# EAGLE design Rolab_PDD_prot (EAGLE 6.2)
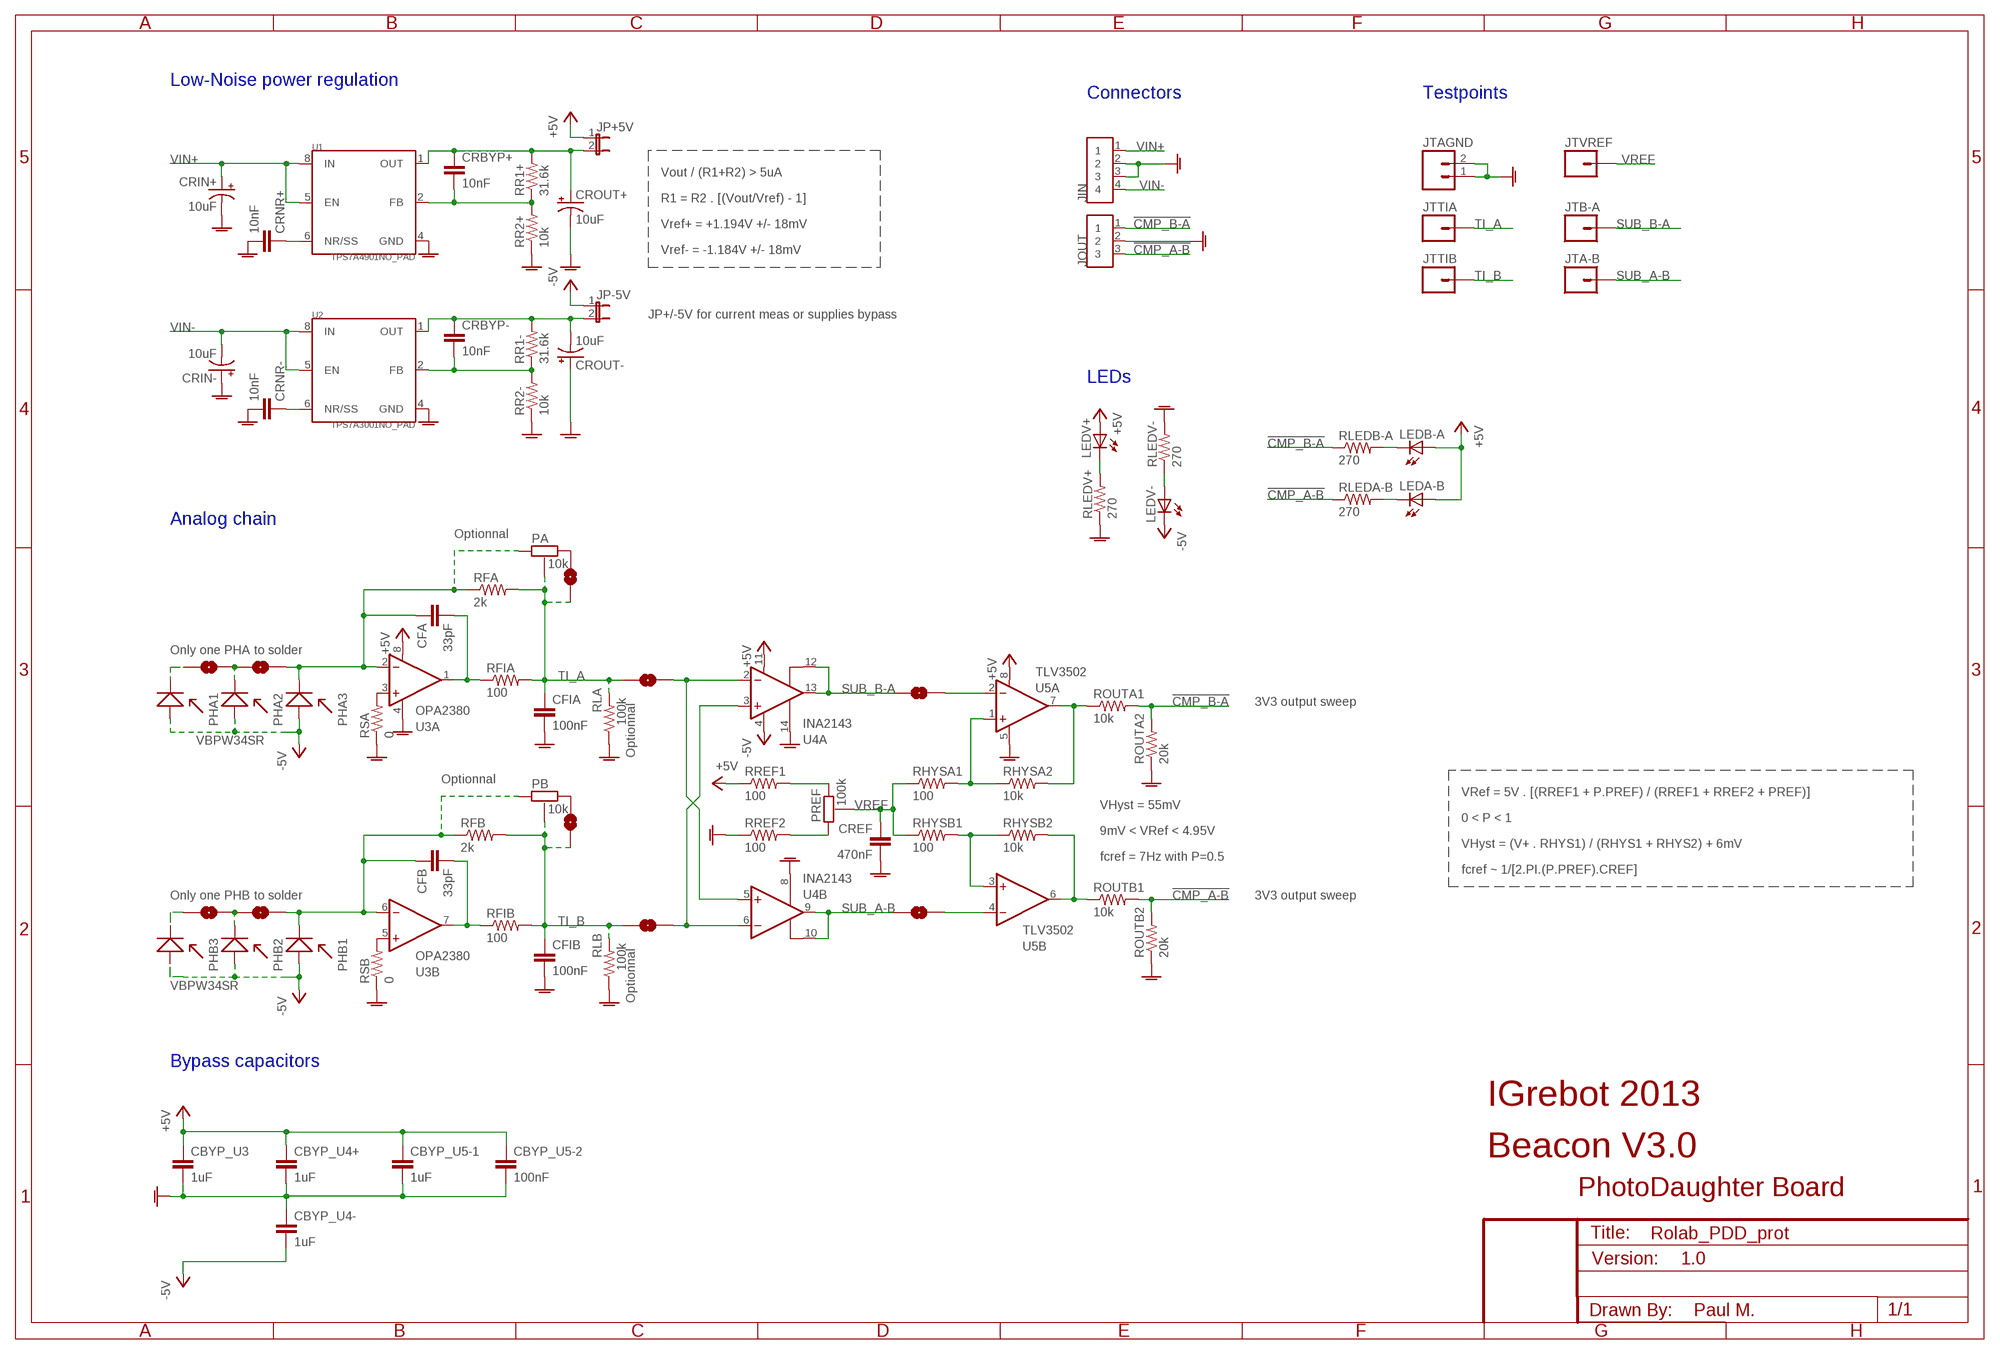
[diagram p0: schematic, sheet 1]

## Parts
CBYP_U3  1uF  CAP0603-CAP  [0603-CAP]
CBYP_U4+  1uF  CAP0603-CAP  [0603-CAP]
CBYP_U4-  1uF  CAP0603-CAP  [0603-CAP]
CBYP_U5-1  1uF  CAP0603-CAP  [0603-CAP]
CBYP_U5-2  100nF  CAP0603-CAP  [0603-CAP]
CFA  33pF  CAP0603-CAP  [0603-CAP]
CFB  33pF  CAP0603-CAP  [0603-CAP]
CFIA  100nF  CAP0603-CAP  [0603-CAP]
CFIB  100nF  CAP0603-CAP  [0603-CAP]
CRBYP+  10nF  CAP0603-CAP  [0603-CAP]
CRBYP-  10nF  CAP0603-CAP  [0603-CAP]
CREF  470nF  CAP0603-CAP  [0603-CAP]
CRIN+  10uF  CAP_POL3528-KIT  [EIA3528-KIT]
CRIN-  10uF  CAP_POL3528-KIT  [EIA3528-KIT]
CRNR+  10nF  CAP0603-CAP  [0603-CAP]
CRNR-  10nF  CAP0603-CAP  [0603-CAP]
CROUT+  10uF  CAP_POL3528-KIT  [EIA3528-KIT]
CROUT-  10uF  CAP_POL3528-KIT  [EIA3528-KIT]
JIN  SIL4  [CON4-2.54]
JOUT  SIL3  [CON3-2.54]
JP+5V  JUMPER-2PTH_LOCK  [1X02_LOCK]
JP-5V  JUMPER-2PTH_LOCK  [1X02_LOCK]
JTA-B  M01PTH  [1X01]
JTAGND  M02LOCK  [1X02_LOCK]
JTB-A  M01PTH  [1X01]
JTTIA  M01PTH  [1X01]
JTTIB  M01PTH  [1X01]
JTVREF  M01PTH  [1X01]
LEDA-B  LED0603  [LED-0603]
LEDB-A  LED0603  [LED-0603]
LEDV+  LED0603  [LED-0603]
LEDV-  LED0603  [LED-0603]
PA  10k  PVZ2A  [TRIM-PVZ2A]
PB  10k  PVZ2A  [TRIM-PVZ2A]
PHA1  VBPW34SR  [VBPW34SR]
PHA2  VBPW34SR  [VBPW34SR]
PHA3  VBPW34SR  [VBPW34SR]
PHB1  VBPW34SR  [VBPW34SR]
PHB2  VBPW34SR  [VBPW34SR]
PHB3  VBPW34SR  [VBPW34SR]
PREF  100k  PVZ2A  [TRIM-PVZ2A]
RFA  2k  RESISTOR0603-RES  [0603-RES]
RFB  2k  RESISTOR0603-RES  [0603-RES]
RFIA  100  RESISTOR0603-RES  [0603-RES]
RFIB  100  RESISTOR0603-RES  [0603-RES]
RHYSA1  100  RESISTOR0603-RES  [0603-RES]
RHYSA2  10k  RESISTOR0603-RES  [0603-RES]
RHYSB1  100  RESISTOR0603-RES  [0603-RES]
RHYSB2  10k  RESISTOR0603-RES  [0603-RES]
RLA  100k  RESISTOR0603-RES  [0603-RES]
RLB  100k  RESISTOR0603-RES  [0603-RES]
RLEDA-B  270  RESISTOR0603-RES  [0603-RES]
RLEDB-A  270  RESISTOR0603-RES  [0603-RES]
RLEDV+  270  RESISTOR0603-RES  [0603-RES]
RLEDV-  270  RESISTOR0603-RES  [0603-RES]
ROUTA1  10k  RESISTOR0603-RES  [0603-RES]
ROUTA2  20k  RESISTOR0603-RES  [0603-RES]
ROUTB1  10k  RESISTOR0603-RES  [0603-RES]
ROUTB2  20k  RESISTOR0603-RES  [0603-RES]
RR1+  31.6k  RESISTOR0603-RES  [0603-RES]
RR1-  31.6k  RESISTOR0603-RES  [0603-RES]
RR2+  10k  RESISTOR0603-RES  [0603-RES]
RR2-  10k  RESISTOR0603-RES  [0603-RES]
RREF1  100  RESISTOR0603-RES  [0603-RES]
RREF2  100  RESISTOR0603-RES  [0603-RES]
RSA  0  RESISTOR0603-RES  [0603-RES]
RSB  0  RESISTOR0603-RES  [0603-RES]
SJ1  SOLDERJUMPERNC  [SJ_2S]
SJ2  SOLDERJUMPERNC  [SJ_2S]
SJ3  SOLDERJUMPERNC  [SJ_2S]
SJ4  SOLDERJUMPERNC  [SJ_2S]
SJ5  SOLDERJUMPERNC  [SJ_2S]
SJ6  SOLDERJUMPERNC  [SJ_2S]
SJ7  SOLDERJUMPERNC  [SJ_2S]
SJ8  SOLDERJUMPERNC  [SJ_2S]
SJ9  SOLDERJUMPERNC  [SJ_2S]
SJ11  SOLDERJUMPERNC  [SJ_2S]
U1  TPS7A4901NO_PAD  [MSOP8]
U2  TPS7A3001NO_PAD  [MSOP8]
U3  OPA2380  [MSOP8]
U4  INA2143  [SOIC14]
U5  TLV3502  [SOIC8]

## Nets
!CMP_A-B!: JOUT.3 RLEDA-B.1 ROUTB1.2 ROUTB2.2
!CMP_B-A!: JOUT.1 RLEDB-A.1 ROUTA1.2 ROUTA2.2
+5V: CBYP_U3.1 CBYP_U4+.1 CBYP_U5-1.1 CBYP_U5-2.1 JP+5V.1 LEDA-B.A LEDB-A.A LEDV+.A RREF1.1 U3.8(A:V+) U4.11(A:V+) U5.8(A:V+)
-5V: CBYP_U4-.2 JP-5V.1 LEDV-.C PHA1.A PHA2.A PHA3.A PHB1.A PHB2.A PHB3.A U4.4(A:V-)
AGND: CBYP_U3.2 CBYP_U4+.2 CBYP_U4-.1 CBYP_U5-1.2 CBYP_U5-2.2 CFIA.2 CFIB.2 CREF.2 CRIN+.C(-) CRIN-.A(+) CRNR+.2 CRNR-.2 CROUT+.C(-) CROUT-.A(+) JIN.2 JIN.3 JOUT.2 JTAGND.1 JTAGND.2 RLA.1 RLB.1 RLEDV+.1 RLEDV-.2 ROUTA2.1 ROUTB2.1 RR2+.1 RR2-.1 RREF2.1 RSA.1 RSB.1 U1.4(GND) U2.4(GND) U3.4(A:V-) U4.8(B:REF) U4.14(A:REF) U5.5(A:V-)
N$1: CRNR+.1 U1.6(NR/SS)
N$2: CRBYP-.2 RR1-.1 RR2-.2 U2.2(FB)
N$3: CFA.2 RFIA.1 U3.1(A:OUT)
N$4: CRNR-.1 U2.6(NR/SS)
N$5: CFA.1 PA.3(C) PHA3.K RFA.1 SJ7.2 U3.2(A:-IN)
N$6: CFB.2 RFIB.1 U3.7(B:OUT)
N$7: CRBYP+.2 RR1+.1 RR2+.2 U1.2(FB)
N$8: CFB.1 PB.3(C) PHB1.K RFB.1 SJ5.2 U3.6(B:-IN)
N$9: SJ2.2 U4.3(A:+IN) U4.6(B:-IN)
N$10: RHYSA2.2 ROUTA1.1 U5.7(A:OUT)
N$11: SJ1.2 U4.2(A:-IN) U4.5(B:+IN)
N$12: SJ3.2 U5.2(A:-IN)
N$13: SJ4.2 U5.4(B:-IN)
N$14: RHYSA1.2 RHYSA2.1 U5.1(A:+IN)
N$15: RHYSB1.2 RHYSB2.1 U5.3(B:+IN)
N$16: RHYSB2.2 ROUTB1.1 U5.6(B:OUT)
N$17: PREF.1(A) RREF1.2
N$18: PREF.3(C) RREF2.2
N$19: LEDV+.C RLEDV+.2
N$20: LEDV-.A RLEDV-.1
N$21: LEDB-A.C RLEDB-A.2
N$22: LEDA-B.C RLEDA-B.2
N$23: RSA.2 U3.3(A:+IN)
N$24: RSB.2 U3.5(B:+IN)
N$26: PA.1(A) SJ8.2
N$27: PHB2.K SJ5.1 SJ9.2
N$28: CRBYP+.1 CROUT+.A(+) JP+5V.2 RR1+.2 U1.1(OUT)
N$29: PHA2.K SJ7.1 SJ11.2
N$30: CRBYP-.1 CROUT-.C(-) JP-5V.2 RR1-.2 U2.1(OUT)
N$31: PHA1.K SJ11.1
N$33: PHB3.K SJ9.1
N$9991: PB.1(A) SJ6.2
SUB_A-B: JTA-B.1 SJ4.1 U4.9(B:OUT) U4.10(B:SENSE)
SUB_B-A: JTB-A.1 SJ3.1 U4.12(A:SENSE) U4.13(A:OUT)
TI_A: CFIA.1 JTTIA.1 PA.2(B) RFA.2 RFIA.2 RLA.2 SJ1.1 SJ8.1
TI_B: CFIB.1 JTTIB.1 PB.2(B) RFB.2 RFIB.2 RLB.2 SJ2.1 SJ6.1
VIN+: CRIN+.A(+) JIN.1 U1.5(EN) U1.8(IN)
VIN-: CRIN-.C(-) JIN.4 U2.5(EN) U2.8(IN)
VREF: CREF.1 JTVREF.1 PREF.2(B) RHYSA1.1 RHYSB1.1

## Notes on the sheet
- Low-Noise power regulation
- Connectors | Testpoints
- Vout / (R1+R2) > 5uA
- R1 = R2 . [(Vout/Vref) - 1]
- Vref+ = +1.194V +/- 18mV
- Vref- = -1.184V +/- 18mV
- JP+/-5V for current meas or supplies bypass
- LEDs
- Analog chain
- Optionnal
- Only one PHA to solder
- 3V3 output sweep
- Optionnal
- Optionnal
- VRef = 5V . [(RREF1 + P.PREF) / (RREF1 + RREF2 + PREF)]
- VHyst = 55mV
- 0 < P < 1
- 9mV < VRef < 4.95V
- VHyst = (V+ . RHYS1) / (RHYS1 + RHYS2) + 6mV
- fcref = 7Hz with P=0.5
- fcref ~ 1/[2.PI.(P.PREF).CREF]
- Only one PHB to solder | 3V3 output sweep
- Optionnal
- Bypass capacitors
- IGrebot 2013
- Beacon V3.0
- PhotoDaughter Board
- 1.0
- Paul M.

## Library data of the parts
CBYP_U3 CBYP_U4+ CBYP_U4- CBYP_U5-1 CBYP_U5-2 CFA CFB CFIA CFIB CRBYP+ CRBYP- CREF CRNR+ CRNR- = SparkFun-Passives:CAP: Capacitor Standard 0603 ceramic capacitor, and 0.1" leaded capacitor.
CRIN+ CRIN- CROUT+ CROUT- = SparkFun-Passives:CAP_POL: Capacitor Polarized These are standard SMD and PTH capacitors. Normally 10uF, 47uF, and 100uF in electrolytic and tantalum varieties. Always verify the external diameter of the through hole cap, it varies with capacity, voltage, and manufacturer. The EIA devices should be standard.
JIN = lib_paul_v6:SIL4
JOUT = lib_paul_v6:SIL3
JP+5V JP-5V = SparkFun-Passives:JUMPER-2: Jumper Basic 0.1" spaced jumper. Use with breakaway headers.
JTA-B JTB-A JTTIA JTTIB JTVREF = SparkFun-Connectors:M01: Header 1 Standard 1-pin 0.1" header. Use with straight break away headers (SKU : PRT-00116), right angle break away headers (PRT-00553), swiss pins (PRT-00743), machine pins (PRT-00117), and female headers (PRT-00115).
JTAGND = SparkFun-Connectors:M02: Header 2 Standard 2-pin 0.1" header. Use with straight break away headers (SKU : PRT-00116), right angle break away headers (PRT-00553), swiss pins (PRT-00743), machine pins (PRT-00117), and female headers (PRT-00115). Molex polarized connector foot print use with SKU : PRT-08233 with associated crimp pins and housings.
LEDA-B LEDB-A LEDV+ LEDV- = SparkFun-LED:LED: LEDs Standard schematic elements and footprints for 5mm, 3mm, 1206, and 0603 sized LEDs. 5mm - Spark Fun Electronics SKU : COM-00529 (and others)
PA PB PREF = lib_paul_v6:PVZ2A
PHA1-PHA3 PHB1-PHB3 = lib_paul_v6:VBPW34SR
RFA RFB RFIA RFIB RHYSA1 RHYSA2 RHYSB1 RHYSB2 RLA RLB RLEDA-B RLEDB-A RLEDV+ RLEDV- ROUTA1 ROUTA2 ROUTB1 ROUTB2 RR1+ RR1- RR2+ RR2- RREF1 RREF2 RSA RSB = SparkFun-Passives:RESISTOR: Resistor Basic schematic elements and footprints for 0603, 1206, and PTH resistors.
SJ1-SJ9 SJ11 = SparkFun-Passives:SOLDERJUMPER: Solder Jumper Standard SMD solder jumper. Used to automate production. Two varients : Normally Open and Normally Closed are the same, but have different paste layers. NC will have a large amount of paste and should jumper during reflow.
U1 = lib_paul_v6:TPS7A4901
U2 = lib_paul_v6:TPS7A3001
U3 = lib_paul_v6:OPA2380
U4 = lib_paul_v6:INA2143
U5 = lib_paul_v6:TLV3502

## Board
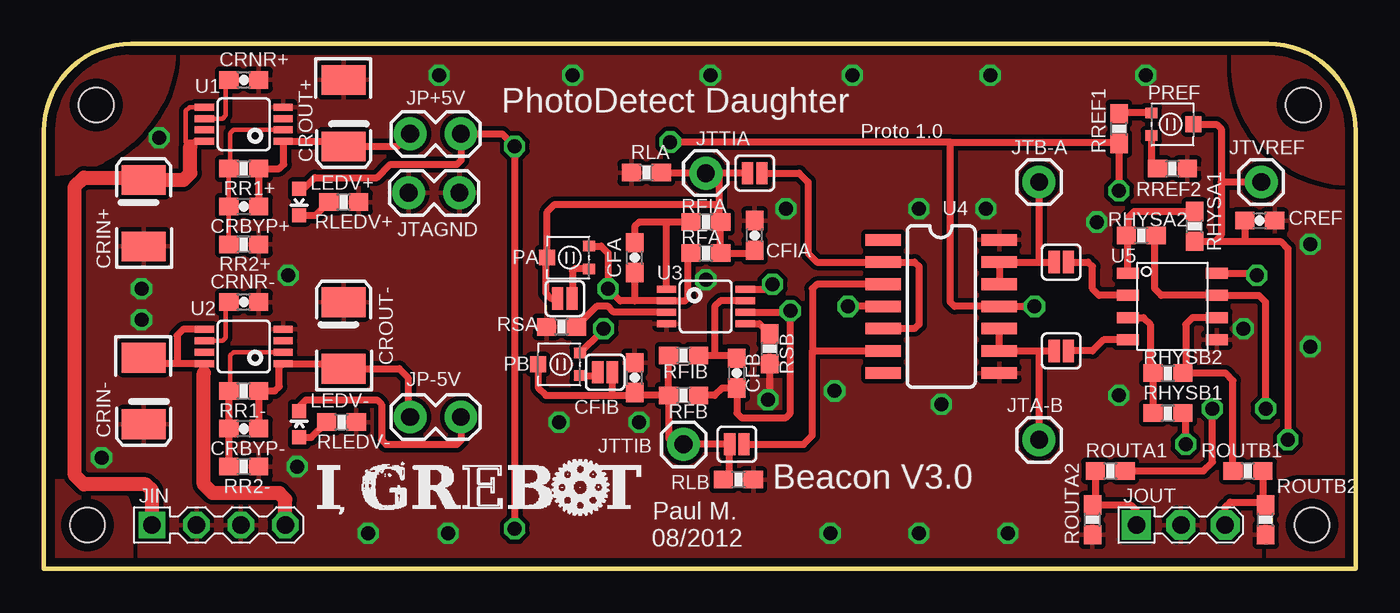
[diagram p1: board, top side]
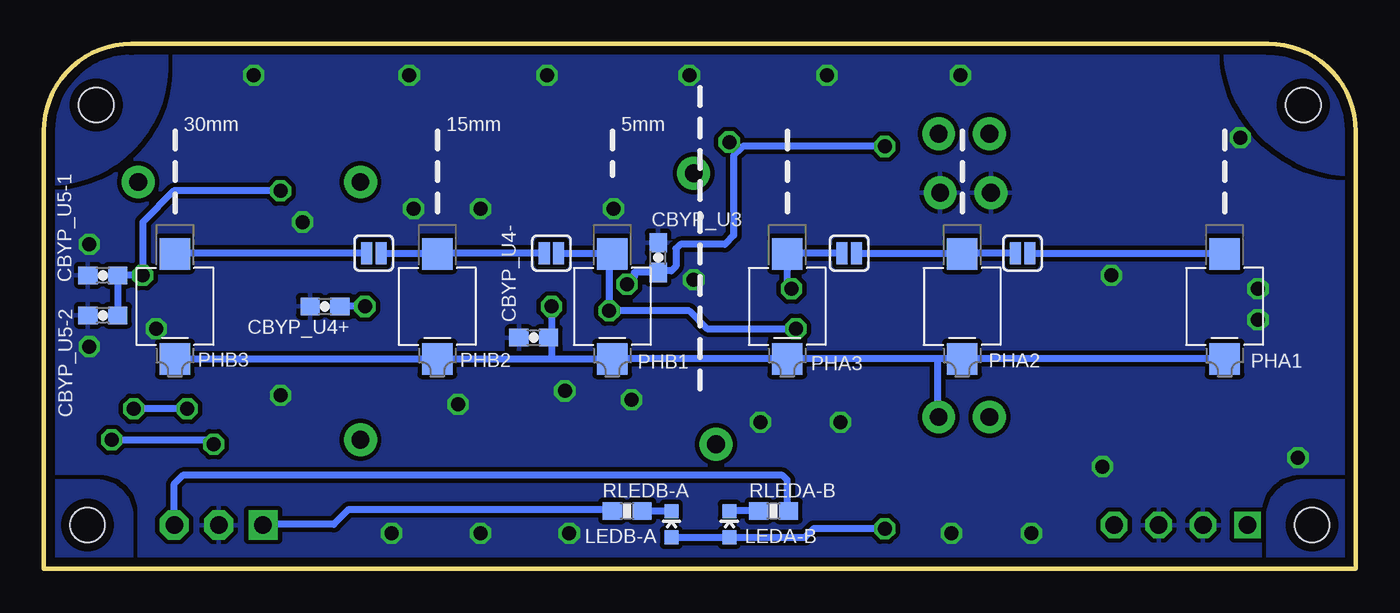
[diagram p2: board, bottom side, seen from below]

Size 75 x 30 mm. Coordinates in mm from the lower left corner, seen from the top.
Outline: 0,0 75,0 75,25 arc90 70,30 5,30 arc90 0,25 0,0
Copper layers (1*16): Top 0.035mm / dielectric 1.5mm / Bottom 0.035mm
Design rules: minimum track width 10mil, minimum drill 24mil, track to track 8mil, track to pad 8mil, pad to pad 8mil, via to via 8mil, smd to smd 8mil, copper to edge 20mil, drill to drill 8mil, minimum pad ring 10mil, minimum via ring 8mil, stop-mask expansion 4mil, vias tented up to drill 0mil, thermal gap 10mil
Holes 2 mm at 2.5,2.5 72.5,2.5 72,26.5 3,26.5

### Footprints (pad centres in the part's own frame; a part is rotated, then mirrored left to right if it is on the bottom)
0603-CAP = smd 1.1 x 1: 1 -0.85,0; 2 0.85,0
EIA3528-KIT = smd 1.7 x 2.5: A 1.9,0; C -1.9,0
CON4-2.54 = drill 1 square: 1 -3.81,0 | drill 1 octagon: 2 -1.27,0; 3 1.27,0; 4 3.81,0
CON3-2.54 = drill 1 pad 1.676 square: 1 -2.54,0 | drill 1 pad 1.676 octagon: 2 0,0; 3 2.54,0
1X02_LOCK = drill 1.016 pad 1.88: 1 -0.178,0; 2 2.718,0
1X01 = drill 1.016 pad 1.88: 1 0,0
LED-0603 = smd 0.8 x 0.8: A 0,-0.75; C 0,0.75
TRIM-PVZ2A = smd 0.6 x 0.7: 1 -0.65,-1.2; 3 0.65,-1.2 | smd 0.9 x 0.9: 2 0,1.2
VBPW34SR = smd 1.8 x 1.75: A -3,0; K 3,0
0603-RES = smd 1.1 x 1: 1 -0.85,0; 2 0.85,0
SJ_2S = smd 0.635 x 1.27: 1 -0.412,0; 2 0.412,0
MSOP8 = smd 0.4 x 1.1: 1 -0.975,-2.25; 2 -0.325,-2.25; 3 0.325,-2.25; 4 0.975,-2.25; 5 0.975,2.25; 6 0.325,2.25; 7 -0.325,2.25; 8 -0.975,2.25
SOIC14 = smd 0.66 x 2.032: 1 -3.81,-3.315; 2 -2.54,-3.315; 3 -1.27,-3.315; 4 0,-3.315; 5 1.27,-3.315; 6 2.54,-3.315; 7 3.81,-3.315; 8 3.81,3.315; 9 2.54,3.315; 10 1.27,3.315; 11 0,3.315; 12 -1.27,3.315; 13 -2.54,3.315; 14 -3.81,3.315
SOIC8 = smd 0.635 x 1.27: 1 -1.905,-2.54; 2 -0.635,-2.54; 3 0.635,-2.54; 4 1.905,-2.54; 5 1.905,2.54; 6 0.635,2.54; 7 -0.635,2.54; 8 -1.905,2.54

### Placement (x,y rotation side)
CBYP_U3  39.88,17.78 90 bottom
CBYP_U4+  58.93,14.99 180 bottom
CBYP_U4-  46.99,13.21 0 bottom
CBYP_U5-1  71.63,16.76 180 bottom
CBYP_U5-2  71.63,14.48 180 bottom
CFA  33.78,17.78 90 top
CFB  39.62,11.18 90 top
CFIA  40.64,19.05 90 top
CFIB  33.78,10.92 90 top
CRBYP+  11.43,20.7 180 top
CRBYP-  11.43,8 180 top
CREF  69.51,19.89 0 top
CRIN+  5.71,20.32 90 top
CRIN-  5.71,10.16 270 top
CRNR+  11.43,27.94 0 top
CRNR-  11.43,15.24 0 top
CROUT+  17.14,26.04 270 top
CROUT-  17.14,13.34 90 top
JIN  10,2.5 0 top
JOUT  65,2.5 0 top
JP+5V  23.66,24.85 180 top
JP-5V  23.66,8.67 180 top
JTA-B  56.9,7.37 0 top
JTAGND  21.04,21.48 0 top
JTB-A  56.9,22.1 0 top
JTTIA  37.85,22.61 0 top
JTTIB  36.58,7.11 0 top
JTVREF  69.6,22.1 0 top
LEDA-B  35.81,2.54 0 bottom
LEDB-A  39.12,2.54 0 bottom
LEDV+  14.61,20.95 180 top
LEDV-  14.61,8.26 0 top
PA  29.97,17.78 90 top
PB  29.46,11.68 90 top
PHA1  7.5,15 90 bottom
PHA2  22.5,15 90 bottom
PHA3  32.5,15 90 bottom
PHB1  42.5,15 90 bottom
PHB2  52.5,15 90 bottom
PHB3  67.5,15 90 bottom
PREF  64.52,25.4 270 top
RFA  37.85,18.03 0 top
RFB  36.58,9.91 180 top
RFIA  37.85,19.81 0 top
RFIB  36.58,12.19 180 top
RHYSA1  65.79,19.56 90 top
RHYSA2  62.74,19.05 0 top
RHYSB1  64.26,8.89 180 top
RHYSB2  64.26,11.18 0 top
RLA  34.46,22.64 0 top
RLB  39.71,5.1 180 top
RLEDA-B  33.27,3.3 180 bottom
RLEDB-A  41.66,3.3 0 bottom
RLEDV+  17.14,20.95 180 top
RLEDV-  17.02,8.38 0 top
ROUTA1  60.96,5.59 180 top
ROUTA2  59.94,2.79 90 top
ROUTB1  68.83,5.59 0 top
ROUTB2  69.85,2.79 90 top
RR1+  11.43,22.86 0 top
RR1-  11.43,10.16 0 top
RR2+  11.43,18.54 180 top
RR2-  11.43,5.84 180 top
RREF1  61.47,25.15 90 top
RREF2  64.52,22.86 180 top
RSA  29.59,13.83 0 top
RSB  41.5,12.57 90 top
SJ1  40.64,22.61 0 top
SJ2  39.62,7.11 0 top
SJ3  58.17,17.53 0 top
SJ4  58.17,12.45 0 top
SJ5  45.97,18.03 0 bottom
SJ6  32.09,11.23 180 top
SJ7  28.96,18.03 180 bottom
SJ8  29.78,15.44 0 top
SJ9  56.13,18.03 0 bottom
SJ11  19.05,18.03 180 bottom
U1  11.43,25.4 90 top
U2  11.43,12.7 90 top
U3  37.85,14.99 270 top
U4  51.31,14.99 270 top
U5  64.52,14.99 270 top

### Tracks (layer width: path | path; a pad name or v marks a point on that pad's centre or on a via)
!CMP_A-B!
  Top 0.406: JOUT.3 67.54,3.53 67.82,3.81 69.68,3.81 | ROUTB1.2 69.68,3.81 | 69.68,3.81 ROUTB2.2
  Bottom 0.406: JOUT.3 67.56,2.52 67.56,4.83 67.06,5.33 32.77,5.33 32.51,5.08 32.51,3.39 RLEDA-B.1
!CMP_B-A!
  Top 0.406: JOUT.1 62.48,2.52 62.48,3.3 62.14,3.64 ROUTA2.2 60.11,3.81 ROUTA1.2
  Bottom 0.406: JOUT.1 62.42,2.54 58.42,2.54 57.57,3.39 42.59,3.39 RLEDB-A.1
+5V  (via drill 0.8)
  Top 0.406: U3.8 41.36,15.96 v41.66,16.26 | v56.64,14.99 U4.11 52.07,14.99 51.82,15.24 51.82,24.38 | U5.8 69.22,16.89 v69.34,16.76 | 51.82,24.38 61.38,24.38 RREF1.1 v61.47,21.59 | 51.82,24.38 v35.81,24.38 | v26.92,2.29 v26.92,24.13 26.2,24.85 JP+5V.1 23.88,24.82 23.88,23.37 23.62,23.11 19.81,23.11 19.05,22.35 15.49,22.35 14.85,21.7 LEDV+.A
  Bottom 0.406: v56.64,14.99 CBYP_U4+.1 | v69.34,16.76 69.85,16.76 | 69.85,16.76 CBYP_U5-1.1 CBYP_U5-2.1 | v61.47,21.59 67.56,21.59 69.34,19.81 69.34,17.02 69.85,16.76 | v26.92,24.13 35.05,24.13 35.18,24 | 35.18,24 35.56,23.62 35.56,19.05 36.07,18.54 38.61,18.54 38.86,18.29 38.86,17.27 39.12,17.02 40.04,17.02 CBYP_U3.1 41.24,16.93 41.24,16.68 v41.66,16.26 | LEDB-A.A LEDA-B.A 31.48,1.79 30.99,2.29 v26.92,2.29 | v35.81,24.38 35.56,24.38 35.18,24
-5V  (via drill 0.8)
  Top 0.406: U4.4 v45.97,14.99 | LEDV-.C 14.61,9.27 14.99,9.65 19.05,9.65 19.3,9.4 19.3,7.37 19.56,7.11 23.62,7.11 23.88,7.37 23.88,8.64 JP-5V.1
  Bottom 0.406: PHA1.A PHA2.A 23.88,12 | v45.97,14.99 45.97,13.37 | 45.97,13.37 CBYP_U4-.2 | PHB3.A PHB2.A 45.97,12 | 45.97,12 PHB1.A PHA3.A 23.88,12 | 45.97,13.37 45.97,12 | JP-5V.1 23.88,8.67 23.88,12
AGND  (via drill 0.8)
  Top 0.406: RSB.1 41.5,9.75 v41.4,9.65
  other vias: 34.04,8.38 29.46,8.38 18.54,2.03 23.11,2.03 44.96,2.03 50.04,2.03 55.12,2.03 51.31,9.4 50.04,20.57 45.21,10.16 42.42,20.57 22.61,28.19 30.23,28.19 38.1,28.19 46.23,28.19 54.1,28.19 62.99,28.19 61.47,9.91 5.59,16 5.59,14.22 3.3,6.35 6.6,24.64 13.97,16.76 14.48,5.84 53.85,20.57 60.2,19.81 72.39,12.7 72.39,18.54 68.58,13.72 37.85,16.51
  pour Top (isolate 0.254, rank 2): -0.25,-0.25 -0.25,30.48 75.44,30.48 75.44,-0.25
  pour Bottom (isolate 0.254, rank 5): -0.25,-0.25 75.44,-0.25 75.44,30.23 -0.51,30.23 -0.51,-0.25
GNDHOLE
  pour Top (isolate 0.254): 7.5,30 arc-90 0,22.5 0,25.5 arc-90 5.5,30
  pour Bottom (isolate 0.254): 7.5,30 arc-90 0,22.5 0,25.5 arc-90 5.5,30
  pour Top (isolate 0.254): 75,22 75,25 arc90 70,30 68,30 68,28.5 arc90
  pour Bottom (isolate 0.254): 75,22 75,25 arc90 70,30 68,30 68,28.5 arc90
  pour Top (isolate 0.254): 0,0 5,0 5,3 arc90 3,5 0,5
  pour Bottom (isolate 0.254): 0,0 5,0 5,3 arc90 3,5 0,5
  pour Top (isolate 0.254): 75,0 70,0 70,3 arc-90 72,5 75,5
  pour Bottom (isolate 0.254): 75,0 70,0 70,3 arc-90 72,5 75,5
N$1
  Top 0.254: U1.6 10.23,25.73 10.41,25.91 10.41,27.77 CRNR+.1
N$2
  Top 0.254: U2.2 10.85,12.38 10.67,12.19 10.67,10.25 RR1-.1
  Top 0.406: RR1-.1 CRBYP-.2 RR2-.2
N$3
  Top 0.406: RFIA.1 35.56,19.81 | 35.56,19.81 34.04,19.81 33.78,19.56 CFA.2 | U3.1 35.6,19.78 35.56,19.81
N$4
  Top 0.254: U2.6 10.23,13.03 10.41,13.21 10.41,15.07 CRNR-.1
N$5  (via drill 0.8)
  Top 0.406: 33.78,15.31 U3.2 36.65,15.31 36.83,15.49 36.83,17.61 RFA.1 | 33.78,15.31 32.95,15.31 v32.26,16 32.26,18.03 31.86,18.43 PA.3 | CFA.1 33.78,15.31
  Bottom 0.406: 32.47,18.54 PHA3.K | PHA3.K 32.51,18.56 32.51,16.26 v32.26,16 | SJ7.2 32.5,18.03 PHA3.K
N$6
  Top 0.406: U3.7 38.68,15.31 38.35,14.99 38.35,12.19 | RFIB.1 38.35,12.19 | 38.35,12.19 39.46,12.19 CFB.2
N$7
  Top 0.254: RR2+.2 CRBYP+.2 RR1+.1 10.67,22.95 10.67,24.89 10.85,25.07 U1.2
N$8  (via drill 0.8)
  Top 0.406: U3.6 42.35,14.66 v42.67,14.73 42.67,8.89 42.42,8.64 39.88,8.64 39.62,8.89 CFB.1 38.77,10.33 38.35,9.91 RFB.1 | PB.3 31.79,13.46 31.79,13.5 v32,13.72
  Bottom 0.406: SJ5.2 42.5,18.03 PHB1.K 42.59,18.57 42.67,18.49 42.42,18.49 42.67,18.29 v42.67,14.73 38.1,14.73 37.08,13.72 v32,13.72
N$9
  Top 0.406: SJ2.2 43.43,7.11 43.94,7.62 43.94,12.45 | 43.94,12.45 U4.6 | U4.3 44.2,16.26 43.94,16 43.94,12.45
N$10  (via drill 0.8)
  Top 0.406: RHYSA2.2 63.5,18.96 63.5,16 63.88,15.62 U5.7 69.47,15.62 69.85,15.24 v69.85,9.14 | ROUTA1.1 66.29,5.59 66.8,6.1 v66.8,9.14
  Bottom 0.406: v66.8,9.14 v69.85,9.14
N$11
  Top 0.406: SJ1.2 43.18,22.61 43.69,22.1 43.69,18.03 44.2,17.53 U4.2 49.78,17.53 50.04,17.27 50.04,13.97 49.78,13.72 U4.5
N$12
  Top 0.406: SJ3.2 59.69,17.53 59.94,17.27 59.94,16 60.33,15.62 U5.2
N$13
  Top 0.406: U5.4 60.58,13.08 59.94,12.45 SJ4.2
N$14
  Top 0.406: U5.1 61.98,18.96 RHYSA2.1 61.98,19.14 61.98,20.07 62.32,20.41 RHYSA1.2
N$15
  Top 0.406: U5.3 62.87,14.35 63.25,13.97 63.25,11.34 RHYSB2.1 RHYSB1.2
N$16
  Top 0.406: U5.6 65.66,14.35 65.28,13.97 65.28,11.34 RHYSB2.2 67.56,11.18 67.98,10.76 ROUTB1.1
N$17
  Top 0.406: PREF.1 61.52,26.05 RREF1.2
N$18
  Top 0.406: PREF.3 63.32,23.21 RREF2.2
N$19
  Top 0.406: LEDV+.C 15.54,20.2 RLEDV+.2
N$20
  Top 0.406: LEDV-.A 15.29,7.5 RLEDV-.1
N$21
  Bottom 0.406: LEDB-A.C 40.79,3.29 RLEDB-A.2
N$22
  Bottom 0.406: RLEDA-B.2 35.8,3.3 LEDA-B.C
N$23
  Top 0.406: U3.3 32.58,14.66 32.26,14.99 31.6,14.99 RSA.2
N$24
  Top 0.406: U3.5 40.91,14.01 RSB.2
N$26
  Top 0.406: PA.1 30.34,17.13 30.23,17.02 30.23,15.47 SJ8.2
N$27
  Bottom 0.406: 52.47,18.54 PHB2.K 52.5,18.03 | SJ5.1 52.5,18.03 | SJ9.2 52.5,18.03
N$28
  Top 0.406: CRBYP+.1 RR1+.2 13.46,22.86 13.72,23.11 13.72,24.39 U1.1 16.86,24.43 CROUT+.A 20.23,24.14 JP+5V.2
N$29
  Bottom 0.406: 22.53,18.54 PHA2.K | 22.47,18.54 PHA2.K | SJ11.2 22.5,18.03 | SJ7.1 22.5,18.03 | 22.5,18.03 PHA2.K
N$30
  Top 0.406: CRBYP-.1 RR1-.2 13.21,10.16 13.46,10.41 13.46,11.51 U2.1 16.86,11.72 CROUT-.C 20.32,11.44 20.83,10.92 20.83,8.79 JP-5V.2
N$31
  Bottom 0.406: SJ11.1 7.5,18.03 PHA1.K
N$33
  Bottom 0.406: 67.47,18.54 PHB3.K 67.5,18.03 SJ9.1
N$9991
  Top 0.406: PB.1 31.48,11.03 SJ6.2
SUB_A-B
  Top 0.406: U4.10 U4.9 56.9,12.45 | 56.9,12.45 SJ4.1 | 56.9,12.45 JTA-B.1
SUB_B-A
  Top 0.406: U4.12 U4.13 56.9,17.53 | 56.9,17.53 SJ3.1 | JTB-A.1 56.9,17.53
TI_A
  Top 0.406: CFIA.1 40.47,18.03 RFA.2 RFIA.2 38.61,19.9 38.61,20.57 | 38.61,22.61 38.61,20.57 | SJ1.1 38.61,22.61 | 38.61,22.61 JTTIA.1 37.85,22.64 RLA.2 | 38.61,20.57 38.35,20.83 29.21,20.83 28.77,20.39 PA.2 28.7,17.71 28.7,15.75 29.01,15.44 SJ8.1
TI_B
  Top 0.406: RFB.2 RFIB.2 | RFB.2 33.95,9.91 CFIB.1 33.62,9.91 32.51,9.91 | RFB.2 35.73,7.45 36.07,7.11 JTTIB.1 SJ2.1 39.21,5.1 RLB.2 | PB.2 28.26,10.34 28.7,9.91 32.51,9.91 | SJ6.1 32.5,9.92 32.51,9.91
VIN+
  Top 0.254: U1.5 8.34,26.38 8.13,26.16 8.13,24.38 8.38,24.13
  Top 0.406: U1.8 8.68,24.43 8.38,24.13
  Top 0.813: JIN.1 6.19,4.48 5.84,4.83 2.29,4.83 1.78,5.33 1.78,21.84 2.29,22.35 5.58,22.35 CRIN+.A 8,22.22 8.38,22.61 8.38,24.13
VIN-
  Top 0.406: 7.62,11.72 U2.8 9.14,11.54 9.14,11.18 | 7.62,11.72 6.05,11.72 CRIN-.C | U2.5 7.96,13.68 7.62,13.34 7.62,11.72
  Top 0.813: JIN.4 13.81,3.97 13.46,4.32 9.65,4.32 9.14,4.83 9.14,11.18
VREF  (via drill 0.8)
  Top 0.406: PREF.2 67.06,25.4 67.31,25.15 67.31,22.1 | 67.31,22.1 67.31,19.05 66.97,18.71 RHYSA1.1 68.58,18.71 | 68.58,18.71 70.7,18.71 71.12,18.29 v71.12,7.37 | v65.28,7.11 65.28,8.72 RHYSB1.1 | JTVREF.1 67.31,22.1 | CREF.1 68.66,18.79 68.58,18.71
  Bottom 0.406: v71.12,7.37 65.53,7.37 v65.28,7.11

### Text on the board
tNames: PhotoDetect Daughter | Proto 1.0 | Beacon V3.0 | Paul M. | 08/2012
bNames: 5mm | 15mm | 30mm